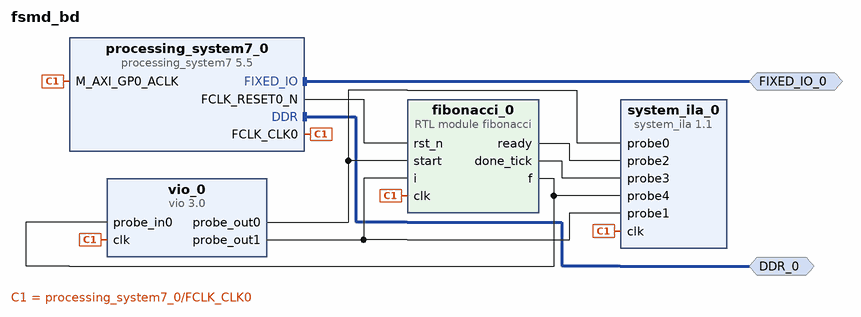
[diagram p0: block diagram of the top level]
# Vivado block design fsmd_bd, xc7z020clg484-1, Vivado 2020.1
create_bd_design fsmd_bd

create_bd_intf_port -mode Master -vlnv xilinx.com:interface:ddrx_rtl:1.0 DDR_0
create_bd_intf_port -mode Master -vlnv xilinx.com:display_processing_system7:fixedio_rtl:1.0 FIXED_IO_0

create_bd_cell -type ip -vlnv xilinx.com:ip:processing_system7:5.5 processing_system7_0
# 1 more settings of processing_system7_0 are not shown: defaults, MIO pin electricals, DDR timing, and values the tool derives
create_bd_cell -type ip -vlnv xilinx.com:ip:system_ila:1.1 system_ila_0
set_property -dict {CONFIG.C_MON_TYPE NATIVE CONFIG.C_NUM_OF_PROBES 5} [get_bd_cells system_ila_0]
create_bd_cell -type ip -vlnv xilinx.com:ip:vio:3.0 vio_0
set_property -dict {CONFIG.C_NUM_PROBE_OUT 2 CONFIG.C_PROBE_OUT1_WIDTH 5} [get_bd_cells vio_0]
create_bd_cell -type module -reference fibonacci fibonacci_0

# ---- connections ----

connect_bd_intf_net [get_bd_intf_ports FIXED_IO_0] [get_bd_intf_pins processing_system7_0/FIXED_IO]
connect_bd_intf_net [get_bd_intf_ports DDR_0] [get_bd_intf_pins processing_system7_0/DDR]
connect_bd_net [get_bd_pins processing_system7_0/FCLK_CLK0] \
  [get_bd_pins system_ila_0/clk] [get_bd_pins fibonacci_0/clk] [get_bd_pins processing_system7_0/M_AXI_GP0_ACLK] \
  [get_bd_pins vio_0/clk]
connect_bd_net [get_bd_pins vio_0/probe_out0] [get_bd_pins fibonacci_0/start] [get_bd_pins system_ila_0/probe0]
connect_bd_net [get_bd_pins processing_system7_0/FCLK_RESET0_N] [get_bd_pins fibonacci_0/rst_n]
connect_bd_net [get_bd_pins vio_0/probe_out1] [get_bd_pins fibonacci_0/i] [get_bd_pins system_ila_0/probe1]
connect_bd_net [get_bd_pins fibonacci_0/f] [get_bd_pins vio_0/probe_in0] [get_bd_pins system_ila_0/probe4]
connect_bd_net [get_bd_pins fibonacci_0/ready] [get_bd_pins system_ila_0/probe2]
connect_bd_net [get_bd_pins fibonacci_0/done_tick] [get_bd_pins system_ila_0/probe3]

validate_bd_design
save_bd_design
